# EAGLE design base1 (EAGLE 7.2.0)
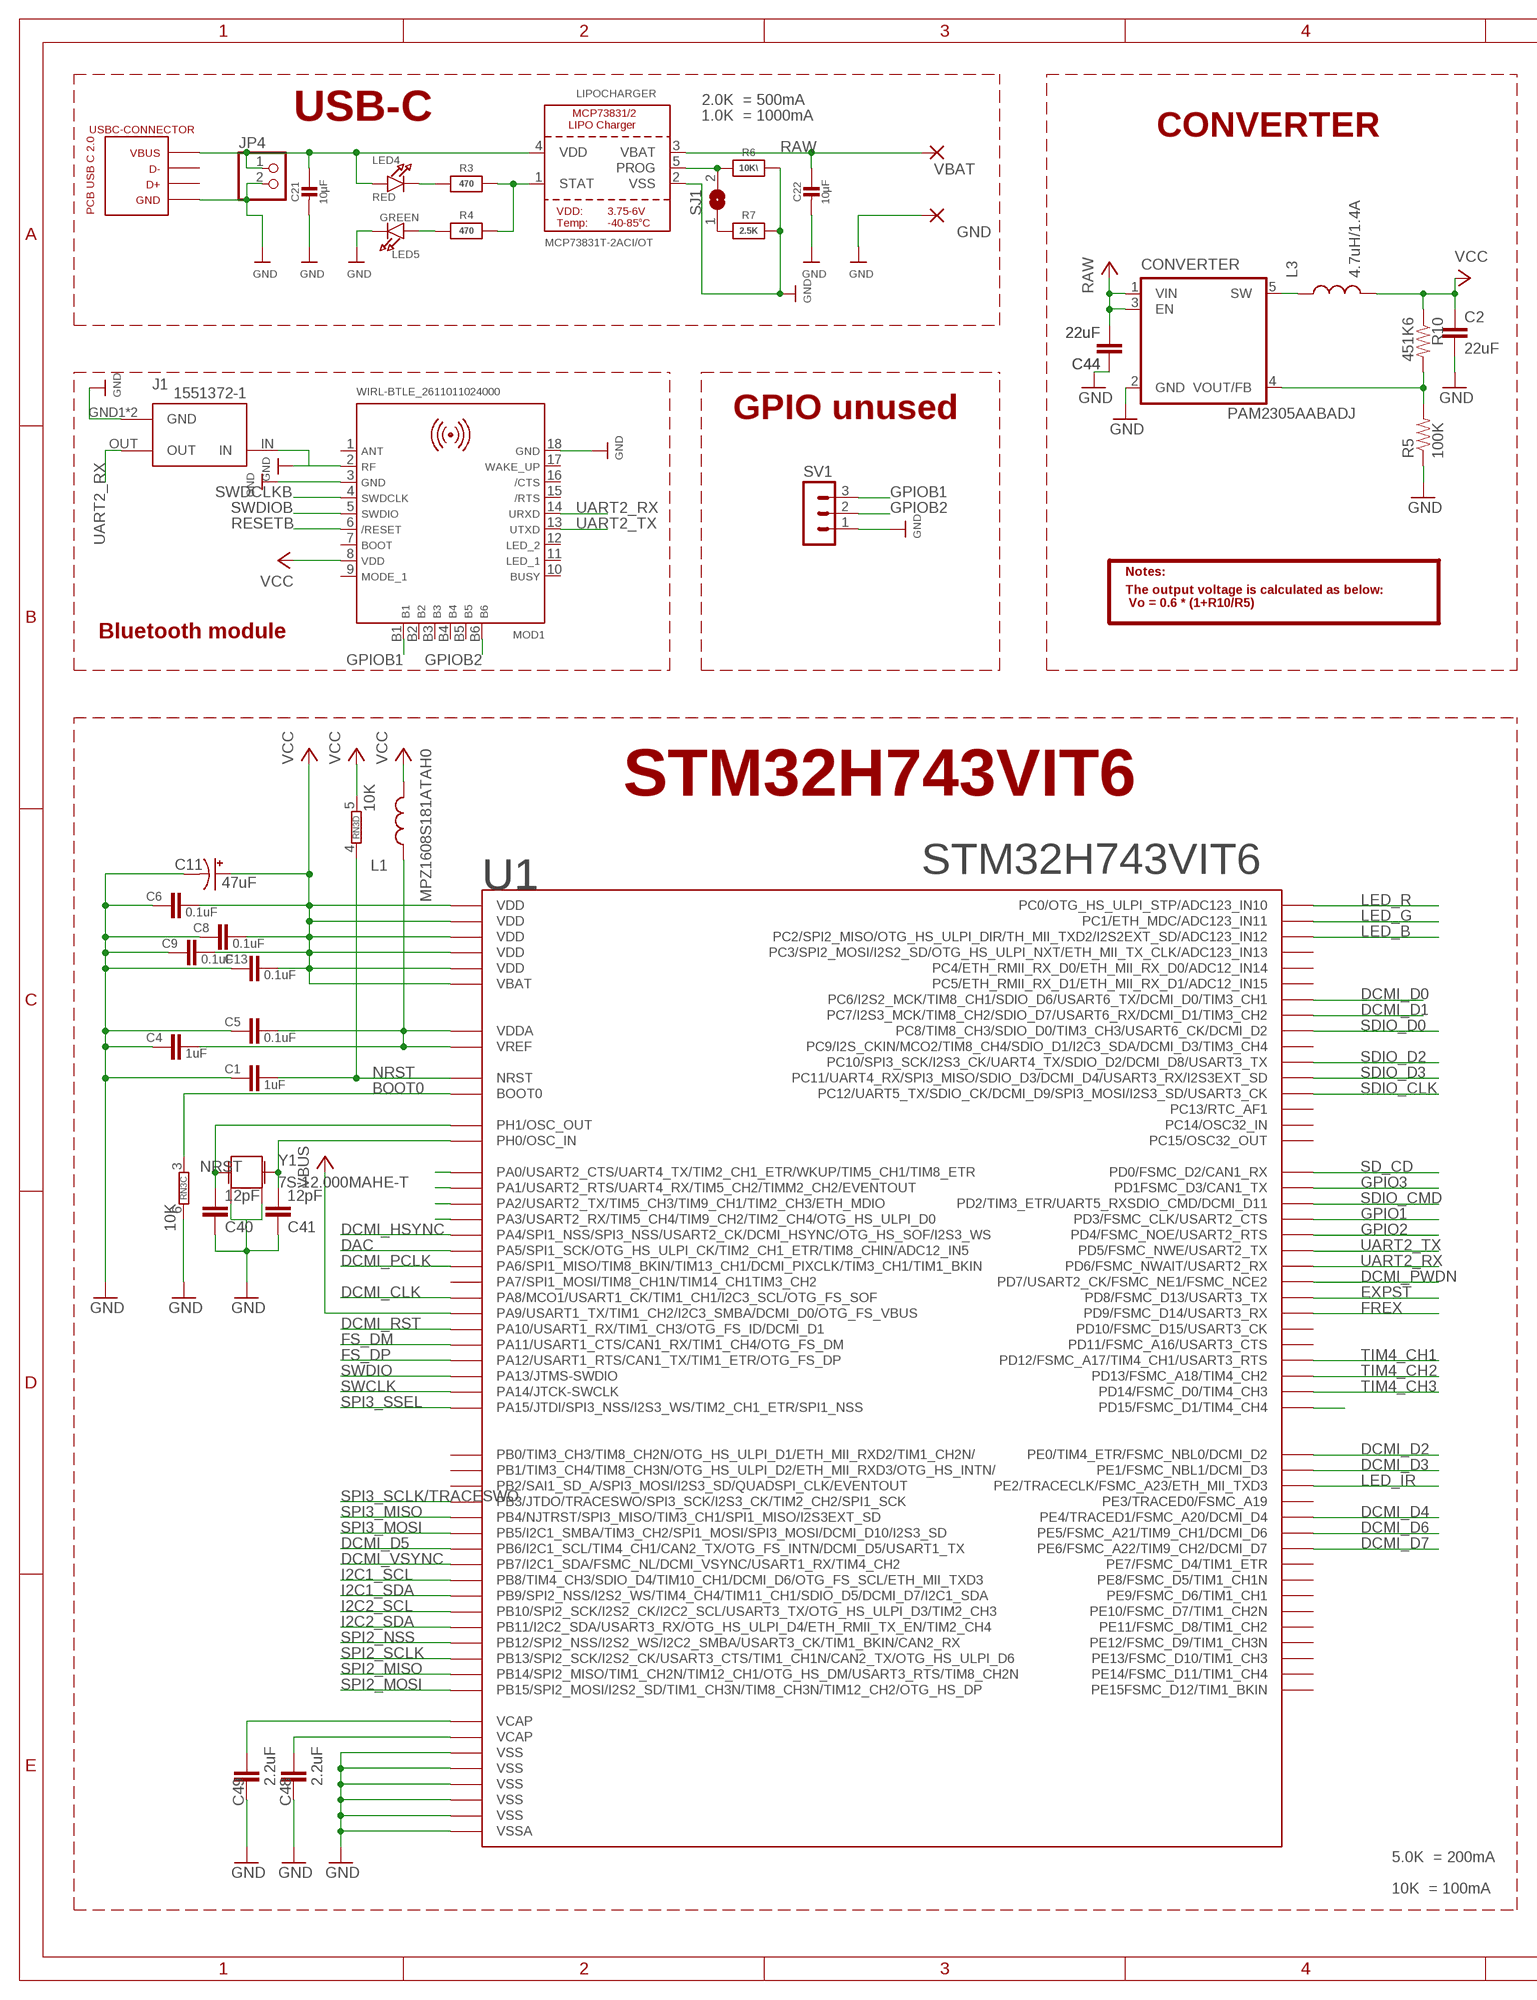
[diagram p0: schematic, sheet 1, part 1 of 2]
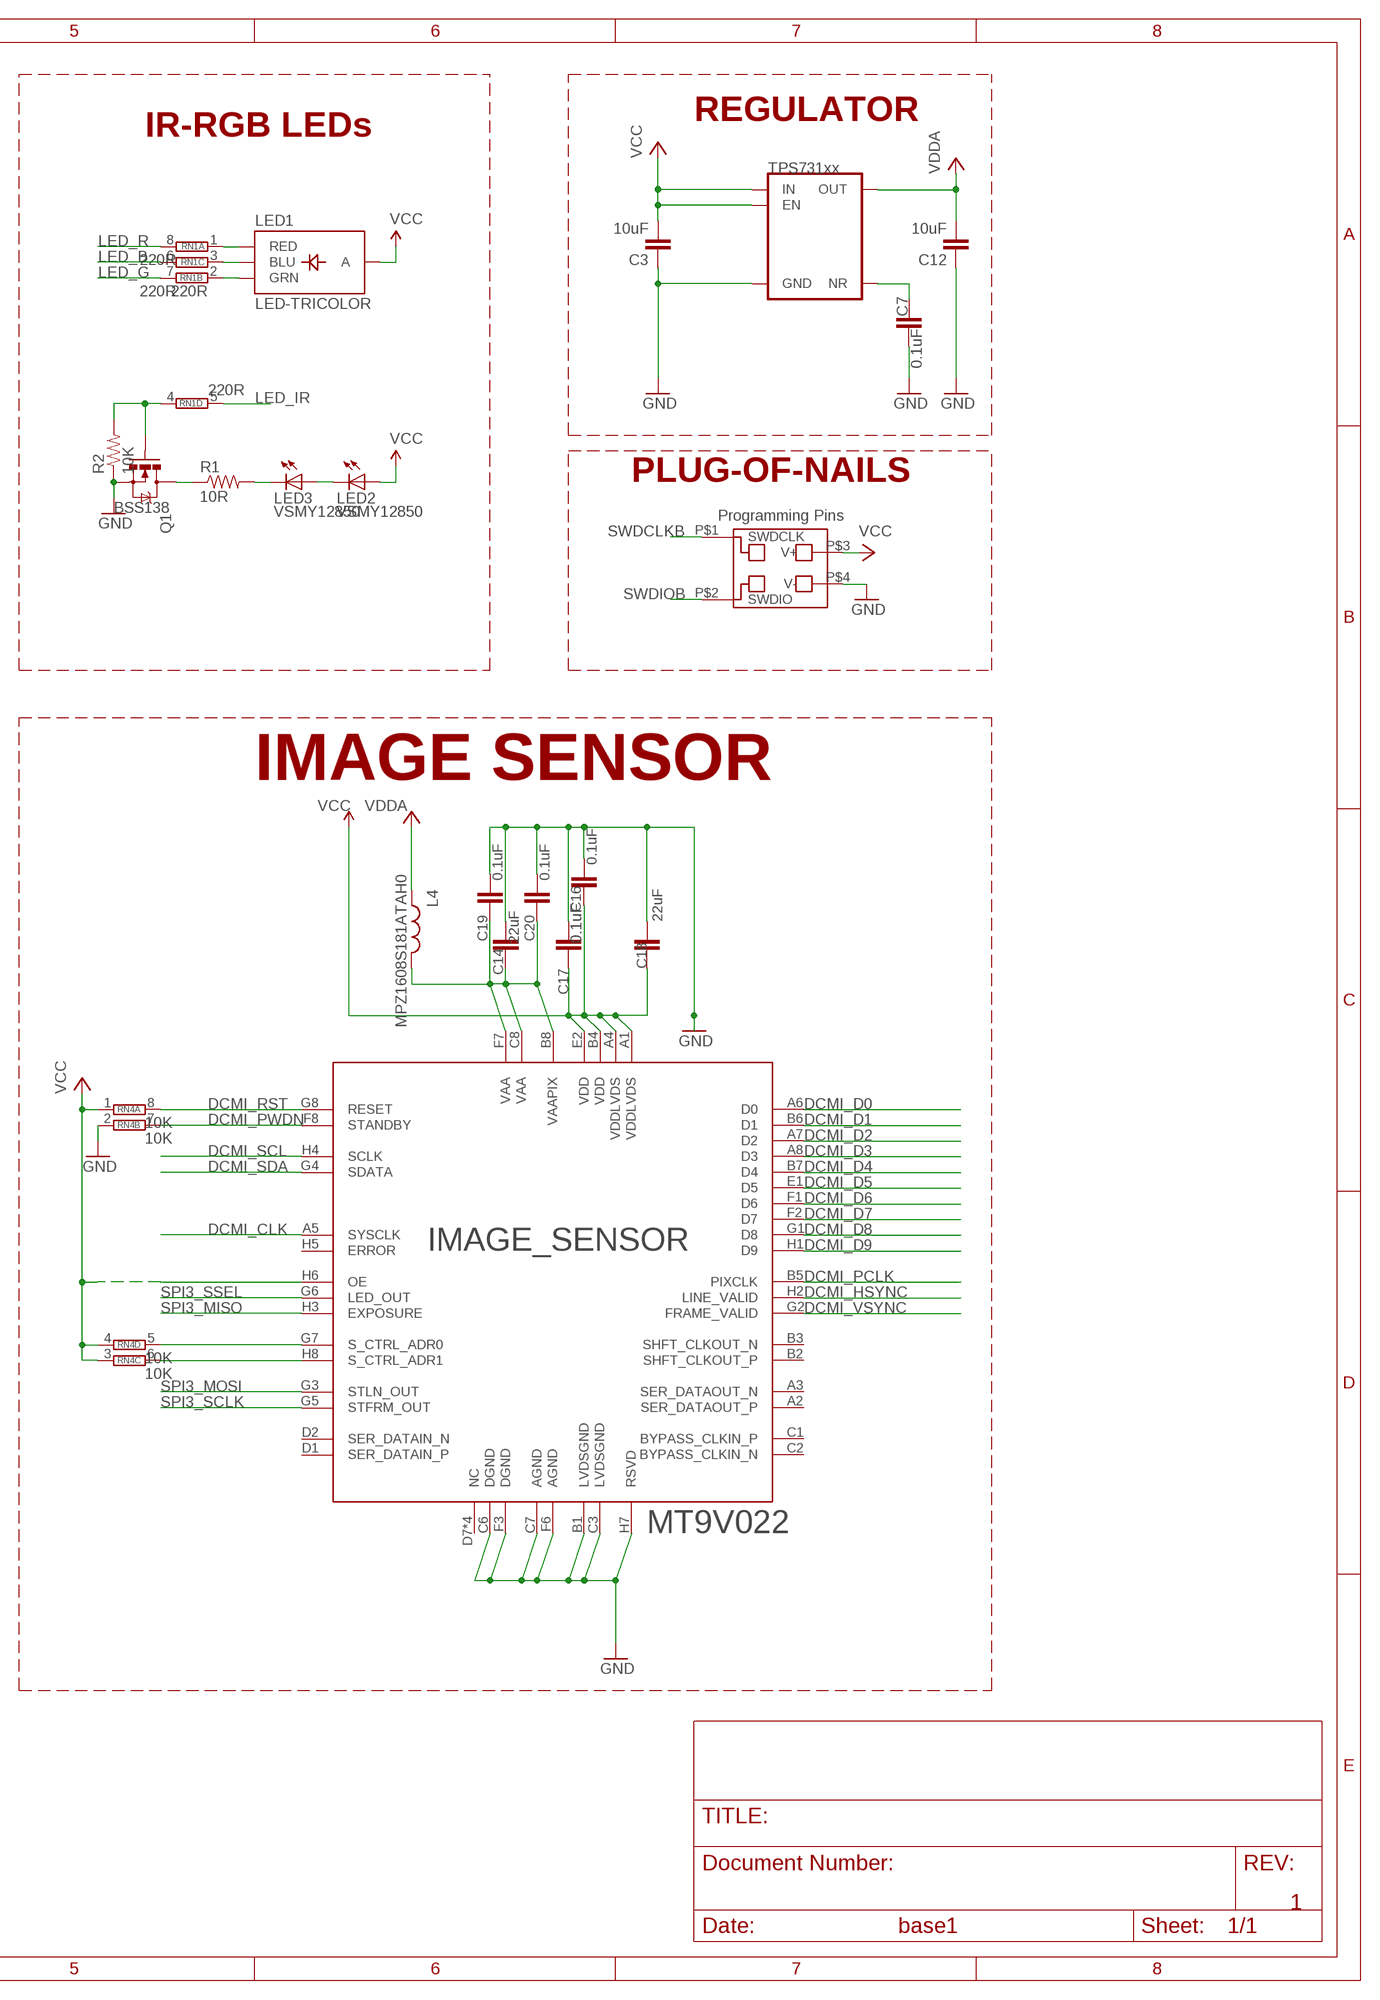
[diagram p1: schematic, sheet 1, part 2 of 2]

## Parts
C1  1uF  CAP0603-CAP  [0603-CAP]
C2  22uF  CAP0805  [0805]
C3  10uF  CAP0805  [0805]
C4  1uF  CAP0603-CAP  [0603-CAP]
C5  0.1uF  CAP0603-CAP  [0603-CAP]
C6  0.1uF  CAP0603-CAP  [0603-CAP]
C7  0.1uF  CAP0603-CAP  [0603-CAP]
C8  0.1uF  CAP0603-CAP  [0603-CAP]
C9  0.1uF  CAP0603-CAP  [0603-CAP]
C11  47uF  CAP_POL1206  [EIA3216]
C12  10uF  CAP0805  [0805]
C13  0.1uF  CAP0603-CAP  [0603-CAP]
C14  22uF  CAP0805  [0805]
C16  0.1uF  CAP0402-CAP  [0402-CAP]
C17  0.1uF  CAP0402-CAP  [0402-CAP]
C18  22uF  CAP0805  [0805]
C19  0.1uF  CAP0402-CAP  [0402-CAP]
C20  0.1uF  CAP0402-CAP  [0402-CAP]
C21  10µF  CAP_CERAMIC0805-NOOUTLINE  [0805-NO]
C22  10µF  CAP_CERAMIC0805-NOOUTLINE  [0805-NO]
C40  12pF  CAP0603-CAP  [0603-CAP]
C41  12pF  CAP0603-CAP  [0603-CAP]
C44  22uF  CAP0805  [0805]
C48  2.2uF  CAP0603-CAP  [0603-CAP]
C49  2.2uF  CAP0603-CAP  [0603-CAP]
CONVERTER  PAM2305AABADJ  PAM2305AAB330  [TSOT25]
GND  SMD2  [SMD1,27-2,54]
IMAGE_SENSOR  MT9V022  [IBGA52]
J1  1551372-1  [TE_1551372-1]
JP4  HEADER-1X2ROUND  [1X02_ROUND]
L1  MPZ1608S181ATAH0  INDUCTOR0603  [0603]
L3  4.7uH/1.4A  INDUCTOR1007  [1007]
L4  MPZ1608S181ATAH0  INDUCTOR0603  [0603]
LED1  LED-TRICOLOR  [LED-TRICOLOR-SMD-MF]
LED2  VSMY12850  LED1206  [LED-1206]
LED3  VSMY12850  LED1206  [LED-1206]
LED4  RED  LED0805_NOOUTLINE  [CHIPLED_0805_NOOUTLINE]
LED5  GREEN  LED0805_NOOUTLINE  [CHIPLED_0805_NOOUTLINE]
LIPOCHARGER  MCP73831T-2ACI/OT  MCP73831/2  [SOT23-5]
MOD1  WIRL-BTLE_2611011024000  [WE-FP-4+]
PROGPINS1  PROGPINS  [PROGPIN]
Q1  BSS138  MOSFET-NCHANNELSMD  [SOT23-3]
R1  10R  RESISTOR0603-RES  [0603-RES]
R2  10K  RESISTOR0603-RES  [0603-RES]
R3  470  RESISTOR0805_NOOUTLINE  [0805-NO]
R4  470  RESISTOR0805_NOOUTLINE  [0805-NO]
R5  100K  RESISTOR0603-RES  [0603-RES]
R6  10K\  RESISTOR0805_NOOUTLINE  [0805-NO]
R7  2.5K  RESISTOR0805_NOOUTLINE  [0805-NO]
R10  451K6  RESISTOR0603-RES  [0603-RES]
REGULATOR  TPS731XX  [SOT23-5]
RN1  220R  4R-NEXBV8V  [EXBV8V]
RN3  10K  4R-NEXBV8V  [EXBV8V]
RN4  10K  4R-NEXBV8V  [EXBV8V]
SJ1  SOLDERJUMPER  [SOLDERJUMPER_ARROW_NOPASTE]
SV1  MA03-1  [MA03-1]
U1  STM32H743VIT6  STM32F746LQFP100  [LQFP100]
USBC-CONNECTOR  PCB_USB_C_2.0DS_2  [USB_TYPE_C_DS_2]
VBAT  SMD2  [SMD1,27-2,54]
Y1  7S-12.000MAHE-T  CRYSTAL2.5X2.0  [CRYSTAL-2.5X2.0]

## Nets
BOOT0: RN3.3 U1.94(BOOT0)
DAC: U1.29(PA5/SPI1_SCK/OTG_HS_ULPI_CK/TIM2_CH1_ETR/TIM8_CHIN/ADC12_IN5)
DCMI_CLK: IMAGE_SENSOR.A5(SYSCLK) U1.67(PA8/MCO1/USART1_CK/TIM1_CH1/I2C3_SCL/OTG_FS_SOF)
DCMI_D0: IMAGE_SENSOR.A6(D0) U1.63(PC6/I2S2_MCK/TIM8_CH1/SDIO_D6/USART6_TX/DCMI_D0/TIM3_CH1)
DCMI_D1: IMAGE_SENSOR.B6(D1) U1.64(PC7/I2S3_MCK/TIM8_CH2/SDIO_D7/USART6_RX/DCMI_D1/TIM3_CH2)
DCMI_D2: IMAGE_SENSOR.A7(D2) U1.97(PE0/TIM4_ETR/FSMC_NBL0/DCMI_D2)
DCMI_D3: IMAGE_SENSOR.A8(D3) U1.98(PE1/FSMC_NBL1/DCMI_D3)
DCMI_D4: IMAGE_SENSOR.B7(D4) U1.3(PE4/TRACED1/FSMC_A20/DCMI_D4)
DCMI_D5: IMAGE_SENSOR.E1(D5) U1.92(PB6/I2C1_SCL/TIM4_CH1/CAN2_TX/OTG_FS_INTN/DCMI_D5/USART1_TX)
DCMI_D6: IMAGE_SENSOR.F1(D6) U1.4(PE5/FSMC_A21/TIM9_CH1/DCMI_D6)
DCMI_D7: IMAGE_SENSOR.F2(D7) U1.5(PE6/FSMC_A22/TIM9_CH2/DCMI_D7)
DCMI_D8: IMAGE_SENSOR.G1(D8)
DCMI_D9: IMAGE_SENSOR.H1(D9)
DCMI_HSYNC: IMAGE_SENSOR.H2(LINE_VALID) U1.28(PA4/SPI1_NSS/SPI3_NSS/USART2_CK/DCMI_HSYNC/OTG_HS_SOF/I2S3_WS)
DCMI_PCLK: IMAGE_SENSOR.B5(PIXCLK) U1.30(PA6/SPI1_MISO/TIM8_BKIN/TIM13_CH1/DCMI_PIXCLK/TIM3_CH1/TIM1_BKIN)
DCMI_PWDN: IMAGE_SENSOR.F8(STANDBY) RN4.7 U1.88(PD7/USART2_CK/FSMC_NE1/FSMC_NCE2)
DCMI_RST: IMAGE_SENSOR.G8(RESET) RN4.8 U1.69(PA10/USART1_RX/TIM1_CH3/OTG_FS_ID/DCMI_D1)
DCMI_SCL: IMAGE_SENSOR.H4(SCLK)
DCMI_SDA: IMAGE_SENSOR.G4(SDATA)
DCMI_VSYNC: IMAGE_SENSOR.G2(FRAME_VALID) U1.93(PB7/I2C1_SDA/FSMC_NL/DCMI_VSYNC/USART1_RX/TIM4_CH2)
EXPST: U1.55(PD8/FSMC_D13/USART3_TX)
FREX: U1.56(PD9/FSMC_D14/USART3_RX)
FS_DM: U1.70(PA11/USART1_CTS/CAN1_RX/TIM1_CH4/OTG_FS_DM)
FS_DP: U1.71(PA12/USART1_RTS/CAN1_TX/TIM1_ETR/OTG_FS_DP)
GND: C1.2 C2.2 C3.1 C4.2 C5.2 C6.2 C7.2 C8.2 C9.2 C11.C(-) C12.1 C13.2 C14.1 C16.2 C17.2 C18.1 C19.2 C20.2 C21.2 C22.2 C40.1 C41.1 C44.1 C48.2 C49.2 CONVERTER.2(GND) GND.1(P) IMAGE_SENSOR.B1(LVDSGND) IMAGE_SENSOR.C3(LVDSGND) IMAGE_SENSOR.C6(DGND) IMAGE_SENSOR.C7(AGND) IMAGE_SENSOR.F3(DGND) IMAGE_SENSOR.F6(AGND) IMAGE_SENSOR.H7(RSVD) J1.GND1(GND) J1.GND2(GND) J1.IN JP4.2 LED5.C LIPOCHARGER.2(VSS) MOD1.2 MOD1.3 MOD1.18 PROGPINS1.P$4(V-) Q1.2(S) R2.1 R5.1 R6.2 R7.2 REGULATOR.2(GND) RN3.6 RN4.2 SV1.1 U1.10(VSS) U1.19(VSSA) U1.26(VSS) U1.49(VSS) U1.74(VSS) U1.99(VSS) USBC-CONNECTOR.A4(VBUS) USBC-CONNECTOR.A9(VBUS) USBC-CONNECTOR.B4(VBUS) USBC-CONNECTOR.B9(VBUS)
GPIO1: U1.84(PD3/FSMC_CLK/USART2_CTS)
GPIO2: U1.85(PD4/FSMC_NOE/USART2_RTS)
GPIO3: U1.82(PD1FSMC_D3/CAN1_TX)
GPIOB1: MOD1.B1 SV1.3
GPIOB2: MOD1.B6 SV1.2
I2C1_SCL: U1.95(PB8/TIM4_CH3/SDIO_D4/TIM10_CH1/DCMI_D6/OTG_FS_SCL/ETH_MII_TXD3)
I2C1_SDA: U1.96(PB9/SPI2_NSS/I2S2_WS/TIM4_CH4/TIM11_CH1/SDIO_D5/DCMI_D7/I2C1_SDA)
I2C2_SCL: U1.46(PB10/SPI2_SCK/I2S2_CK/I2C2_SCL/USART3_TX/OTG_HS_ULPI_D3/TIM2_CH3)
I2C2_SDA: U1.47(PB11/I2C2_SDA/USART3_RX/OTG_HS_ULPI_D4/ETH_RMII_TX_EN/TIM2_CH4)
LED_B: RN1.6 U1.17(PC2/SPI2_MISO/OTG_HS_ULPI_DIR/TH_MII_TXD2/I2S2EXT_SD/ADC123_IN12)
LED_G: RN1.7 U1.16(PC1/ETH_MDC/ADC123_IN11)
LED_IR: RN1.5 U1.1(PE2/TRACECLK/FSMC_A23/ETH_MII_TXD3)
LED_R: RN1.8 U1.15(PC0/OTG_HS_ULPI_STP/ADC123_IN10)
N$1: LED4.C R3.1
N$2: C40.2 U1.13(PH1/OSC_OUT) Y1.3
N$3: LIPOCHARGER.1(STAT) R3.2 R4.2
N$4: C41.2 U1.12(PH0/OSC_IN) Y1.1
N$5: Q1.1(G) R2.2 RN1.4
N$6: LED1.B(BLU) RN1.3
N$8: LED1.R(RED) RN1.1
N$9: LED1.G(GRN) RN1.2
N$10: LED3.C R1.2
N$11: C7.1 REGULATOR.4(NR)
N$12: C4.1 C5.1 L1.1 U1.20(VREF) U1.21(VDDA)
N$13: CONVERTER.4(VOUT/FB) R5.2 R10.2
N$14: Q1.3(D) R1.1
N$15: LIPOCHARGER.5(PROG) R6.1 SJ1.2
N$16: LED5.A R4.1
N$17: LED2.C LED3.A
N$18: R7.1 SJ1.1
N$19: IMAGE_SENSOR.G7(S_CTRL_ADR0) RN4.5
N$20: IMAGE_SENSOR.H8(S_CTRL_ADR1) RN4.6
N$30: U1.62(PD15/FSMC_D1/TIM4_CH4)
N$31: U1.22(PA0/USART2_CTS/UART4_TX/TIM2_CH1_ETR/WKUP/TIM5_CH1/TIM8_ETR)
N$32: U1.23(PA1/USART2_RTS/UART4_RX/TIM5_CH2/TIMM2_CH2/EVENTOUT)
N$33: U1.24(PA2/USART2_TX/TIM5_CH3/TIM9_CH1/TIM2_CH3/ETH_MDIO)
N$34: U1.25(PA3/USART2_RX/TIM5_CH4/TIM9_CH2/TIM2_CH4/OTG_HS_ULPI_D0)
NRST: C1.1 RN3.4 U1.14(NRST)
P$1: Y1.2 Y1.4
RAW: C22.1 C44.2 CONVERTER.1(VIN) CONVERTER.3(EN) LIPOCHARGER.3(VBAT) VBAT.1(P)
RESETB: MOD1.6
SD_CD: U1.81(PD0/FSMC_D2/CAN1_RX)
SDIO_CLK: U1.80(PC12/UART5_TX/SDIO_CK/DCMI_D9/SPI3_MOSI/I2S3_SD/USART3_CK)
SDIO_CMD: U1.83(PD2/TIM3_ETR/UART5_RXSDIO_CMD/DCMI_D11)
SDIO_D0: U1.65(PC8/TIM8_CH3/SDIO_D0/TIM3_CH3/USART6_CK/DCMI_D2)
SDIO_D2: U1.78(PC10/SPI3_SCK/I2S3_CK/UART4_TX/SDIO_D2/DCMI_D8/USART3_TX)
SDIO_D3: U1.79(PC11/UART4_RX/SPI3_MISO/SDIO_D3/DCMI_D4/USART3_RX/I2S3EXT_SD)
SPI2_MISO: U1.53(PB14/SPI2_MISO/TIM1_CH2N/TIM12_CH1/OTG_HS_DM/USART3_RTS/TIM8_CH2N)
SPI2_MOSI: U1.54(PB15/SPI2_MOSI/I2S2_SD/TIM1_CH3N/TIM8_CH3N/TIM12_CH2/OTG_HS_DP)
SPI2_NSS: U1.51(PB12/SPI2_NSS/I2S2_WS/I2C2_SMBA/USART3_CK/TIM1_BKIN/CAN2_RX)
SPI2_SCLK: U1.52(PB13/SPI2_SCK/I2S2_CK/USART3_CTS/TIM1_CH1N/CAN2_TX/OTG_HS_ULPI_D6)
SPI3_MISO: IMAGE_SENSOR.H3(EXPOSURE) U1.90(PB4/NJTRST/SPI3_MISO/TIM3_CH1/SPI1_MISO/I2S3EXT_SD)
SPI3_MOSI: IMAGE_SENSOR.G3(STLN_OUT) U1.91(PB5/I2C1_SMBA/TIM3_CH2/SPI1_MOSI/SPI3_MOSI/DCMI_D10/I2S3_SD)
SPI3_SCLK: IMAGE_SENSOR.G5(STFRM_OUT)
SPI3_SCLK/TRACESWO: U1.89(PB3/JTDO/TRACESWO/SPI3_SCK/I2S3_CK/TIM2_CH2/SPI1_SCK)
SPI3_SSEL: IMAGE_SENSOR.G6(LED_OUT) U1.77(PA15/JTDI/SPI3_NSS/I2S3_WS/TIM2_CH1_ETR/SPI1_NSS)
SW: CONVERTER.5(SW) L3.1
SWCLK: U1.76(PA14/JTCK-SWCLK)
SWDCLKB: MOD1.4 PROGPINS1.P$1(SWDCLK)
SWDIO: U1.72(PA13/JTMS-SWDIO)
SWDIOB: MOD1.5 PROGPINS1.P$2(SWDIO)
TIM4_CH1: U1.59(PD12/FSMC_A17/TIM4_CH1/USART3_RTS)
TIM4_CH2: U1.60(PD13/FSMC_A18/TIM4_CH2)
TIM4_CH3: U1.61(PD14/FSMC_D0/TIM4_CH3)
UART2_RX: J1.OUT MOD1.14 U1.87(PD6/FSMC_NWAIT/USART2_RX)
UART2_TX: MOD1.13 U1.86(PD5/FSMC_NWE/USART2_TX)
VAA: C14.2 C19.1 C20.1 IMAGE_SENSOR.B8(VAAPIX) IMAGE_SENSOR.C8(VAA) IMAGE_SENSOR.F7(VAA) L4.2
VBAT: C2.1 C3.2 C6.1 C8.1 C9.1 C11.A(+) C13.1 C16.1 C17.1 C18.2 IMAGE_SENSOR.A1(VDDLVDS) IMAGE_SENSOR.A4(VDDLVDS) IMAGE_SENSOR.B4(VDD) IMAGE_SENSOR.E2(VDD) IMAGE_SENSOR.H6(OE) L1.2 L3.2 LED1.A LED2.A R10.1 REGULATOR.1(IN) REGULATOR.3(EN) RN3.5 RN4.1 RN4.3 RN4.4 U1.6(VBAT) U1.11(VDD) U1.27(VDD) U1.50(VDD) U1.75(VDD) U1.100(VDD) ; supply symbol labelled VCC
VBUS: U1.68(PA9/USART1_TX/TIM1_CH2/I2C3_SMBA/DCMI_D0/OTG_FS_VBUS)
VCAP1: C49.1 U1.48(VCAP)
VCAP2: C48.1 U1.73(VCAP)
VCC: MOD1.8 PROGPINS1.P$3(V+)
VDD: C21.1 JP4.1 LED4.A LIPOCHARGER.4(VDD) USBC-CONNECTOR.A1(GND) USBC-CONNECTOR.A12(GND) USBC-CONNECTOR.B1(GND) USBC-CONNECTOR.B12(GND)
VDDA: C12.2 L4.1 REGULATOR.5(OUT)
Unconnected: IMAGE_SENSOR.A2(SER_DATAOUT_P) IMAGE_SENSOR.A3(SER_DATAOUT_N) IMAGE_SENSOR.B2(SHFT_CLKOUT_P) IMAGE_SENSOR.B3(SHFT_CLKOUT_N) IMAGE_SENSOR.C1(BYPASS_CLKIN_P) IMAGE_SENSOR.C2(BYPASS_CLKIN_N) IMAGE_SENSOR.D1(SER_DATAIN_P) IMAGE_SENSOR.D2(SER_DATAIN_N) IMAGE_SENSOR.D7(NC) IMAGE_SENSOR.D8(NC) IMAGE_SENSOR.E7(NC) IMAGE_SENSOR.E8(NC) IMAGE_SENSOR.H5(ERROR) MOD1.1 MOD1.7 MOD1.9 MOD1.10 MOD1.11 MOD1.12 MOD1.15 MOD1.16 MOD1.17 MOD1.B2 MOD1.B3 MOD1.B4 MOD1.B5 RN3.1 RN3.2 RN3.7 RN3.8 U1.2(PE3/TRACED0/FSMC_A19) U1.7(PC13/RTC_AF1) U1.8(PC14/OSC32_IN) U1.9(PC15/OSC32_OUT) U1.18(PC3/SPI2_MOSI/I2S2_SD/OTG_HS_ULPI_NXT/ETH_MII_TX_CLK/ADC123_IN13) U1.31(PA7/SPI1_MOSI/TIM8_CH1N/TIM14_CH1TIM3_CH2) U1.32(PC4/ETH_RMII_RX_D0/ETH_MII_RX_D0/ADC12_IN14) U1.33(PC5/ETH_RMII_RX_D1/ETH_MII_RX_D1/ADC12_IN15) U1.34(PB0/TIM3_CH3/TIM8_CH2N/OTG_HS_ULPI_D1/ETH_MII_RXD2/TIM1_CH2N/) U1.35(PB1/TIM3_CH4/TIM8_CH3N/OTG_HS_ULPI_D2/ETH_MII_RXD3/OTG_HS_INTN/) U1.36(PB2/SAI1_SD_A/SPI3_MOSI/I2S3_SD/QUADSPI_CLK/EVENTOUT) U1.37(PE7/FSMC_D4/TIM1_ETR) U1.38(PE8/FSMC_D5/TIM1_CH1N) U1.39(PE9/FSMC_D6/TIM1_CH1) U1.40(PE10/FSMC_D7/TIM1_CH2N) U1.41(PE11/FSMC_D8/TIM1_CH2) U1.42(PE12/FSMC_D9/TIM1_CH3N) U1.43(PE13/FSMC_D10/TIM1_CH3) U1.44(PE14/FSMC_D11/TIM1_CH4) U1.45(PE15FSMC_D12/TIM1_BKIN) U1.57(PD10/FSMC_D15/USART3_CK) U1.58(PD11/FSMC_A16/USART3_CTS) U1.66(PC9/I2S_CKIN/MCO2/TIM8_CH4/SDIO_D1/I2C3_SDA/DCMI_D3/TIM3_CH4) USBC-CONNECTOR.A6(D+) USBC-CONNECTOR.A7(D-) USBC-CONNECTOR.B6(D+) USBC-CONNECTOR.B7(D-)

## Notes on the sheet
- 2.0K  = 500mA
- USB-C | 1.0K  = 1000mA | REGULATOR
- CONVERTER | IR-RGB LEDs
- GPIO unused
- PLUG-OF-NAILS
- Notes:
- The output voltage is calculated as below:
   Vo = 0.6 * (1+R10/R5)
- Bluetooth module
- STM32H743VIT6 | IMAGE SENSOR
- 5.0K  = 200mA
- 10K  = 100mA
- 1

## Library data of the parts
C1-C9 C12-C14 C16-C20 C40 C41 C44 C48 C49 = sfe:CAP: Capacitor Standard 0603 ceramic capacitor, and 0.1" leaded capacitor.
C11 = sfe:CAP_POL: Capacitor Polarized These are standard SMD and PTH capacitors. Normally 10uF, 47uF, and 100uF in electrolytic and tantalum varieties. Always verify the external diameter of the through hole cap, it varies with capacity, voltage, and manufacturer. The EIA devices should be standard.
C21 C22 = microbuilder:CAP_CERAMIC: Ceramic Capacitors For new designs, use the packages preceded by an '_' character since they are more reliable: The following footprints should be used on most boards: _0402 - Standard footprint for regular board layouts _0603 - Standard footprint for regular board layouts _0805 - Standard footprint for regular board layouts _1206 - Standard footprint for regular board layouts For extremely tight-pitch boards where space is at a premium, the following 'micro-pitch' footprints can be used (smaller pads, no silkscreen outline, etc.): _0402MP - Micro-pitch footprint for very dense/compact boards _0603MP - Micro-pitch footprint for very dense/compact boards _0805MP - Micro-pitch footprint for very dense/compact boards _1206MP - Micro-pitch footprint for very dense/compact boards
CONVERTER = regulators:PAM2305AAB330
GND VBAT = wirepad:SMD2: SMD PAD
IMAGE_SENSOR = MT9V022:MT9V022
J1 = 1551372-1:1551372-1: CONN COAX SWITCH JACK STR 50OHM Check availability <https://pricing.snapeda.com/parts/1551372-1/TE%20Connectivity/view-part?ref=eda>; AVAILABILITY: In Stock; CHECK_PRICES: https://www.snapeda.com/parts/1551372-1/TE+Connectivity+AMP+Connectors/view-part/?ref=eda; DESCRIPTION: Coaxial Switch - 1.35mm Plug Dia Connector Jack, Female Socket 50 Ohms Surface Mount Solder; MF: TE Connectivity; MP: 1551372-1; PACKAGE: None; PRICE: None; SNAPEDA_LINK: https://www.snapeda.com/parts/1551372-1/TE+Connectivity+AMP+Connectors/view-part/?ref=snap
JP4 = microbuilder:HEADER-1X2: PIN HEADER
L1 L3 L4 = sfe:INDUCTOR: Inductors Basic Inductor/Choke - 0603 and 1206. Footprints are not proven and vary greatly between part numbers.
LED1 = sfe:LED-TRICOLOR: Tri-Color LED SMD Proven layout and schematic for triple color LED in SMD package - common anode. Spark Fun Electronics SKU : COM-07844
LED2 LED3 = sfe:LED: LEDs Standard schematic elements and footprints for 5mm, 3mm, 1206, and 0603 sized LEDs. 5mm - Spark Fun Electronics SKU : COM-00529 (and others)
LED4 LED5 = microbuilder:LED: LED 0603 - 0603 Surface Mount Package 2mA: Green LED - Low Power (3.9mcd, 2ma, 1.7Vf) - Digikey: 475-2709-2-ND Orange LED - Low Power (9.8mcd, 2ma, 1.8Vf) - Digikey: 475-1194-2-ND Red LED - Low Power (5mcd, 2ma, 1.8Vf) - Digikey: 475-1195-2-ND Yellow LED - Low Power (7mcd, 2ma, 1.8Vf) - Digikey: 475-1196-2-ND 5mA: Blue LED - Low Power (17mcd, 5ma, 2.9Vf) - Digikey: LNJ937W8CRACT-ND 0805 - 0805 Surface Mount Package 2mA: Red LED (8.8mcd, 2mA, 1.8Vf, Clear) - Low Power [Digikey: 475-2510-1-ND] Green LED (5mcd, 2mA, 1.8Vf, Clear) - Low Power [Digikey: 475-2730-1-ND] Yellow LED (11.3mcd, 2mA, 1.8Vf, Clear) - Low Power [Digikey: 475-2555-1-ND] 20mA: Red LED (104mcd, 20mA, Diffused) - LS R976 [Digikey: 475-1278-6-ND] Red LED (12mcd, 20mA, 2.0Vf, Clear) - APT2012EC [Digikey: 754-1128-1-ND] Green LED (15mcd, 20mA, 2.2Vf, Clear) - APT2012GC [Digikey: 754-1131-1-ND] Orange LED (160mcd, 20mA, 2.1Vf, Clear) - APT2012SECK [Digikey: 754-1130-1-ND] 1206 - 1206 Surface Mount Package Green LED (26mcd, 20mA, Diffused) - LG N971 [Digikey: 475-1407-6-ND] Red LED (15mcd, 20mA, Diffused) - LH N974 [Digikey: 475-1416-6-ND] Cree - Cree High-Power Surface Mount LEDs XPEBWT-L1-0000-00D50 - White 111lm 350mA 2.9Vf 6200K 110° XTEAWT-00-0000-00000LEE3 - White 114lm 350mA 2.85Vf 5000K 115° Everlight - Everlight 45-21 Series Surface Mount LEDs 45-21/QK2C-B2832AC2CB2/2T - Warm White 2000mcd 20mA 3.25Vf 3050K 120° 45-21/LK2C-B38452C4CB2/2T - Nuetral White 2000mcd 20mA 3.25Vf 4150K 120° 45-21/LK2C-B50634C6CB2/2T - Cold White 2200mcd 20mA 3.25Vf 5650K 120° PLCC2 Reverse Mount LS T77K-J1L2-1-0-2-R18-Z - Red 11.25mcd 2mA 1.8Vf 630nm 120° LO T77K-L1M2-24-Z - Orange 19.6mcd 2mA 1.8Vf 606nm 120° LY T77K-K2M1-26-Z - Yellow 15.7mcd 2mA 1.8Vf 587nm 120°
LIPOCHARGER = microbuilder:MCP73831/2: MCP73831/2 LIPO Charger VDD: 3.75 - 6V Temp -40 - 85°C Programmable Charge Rate: 15-500mA NOTE: STAT is a tri-state logic output on the MCP73831 and an open-drain output on the MCP73832. SOT23-5 with 4.2V output and tri-state logic on STAT = MCP73831T-2ACI/OT
MOD1 = WE_WIRL_Rev13.0:WIRL-BTLE_2611011024000: Proteus-III - Bluetooth® LE 5.1 Module WIRL-BTLE Bluetooth® LE 5.1 Module Details see: https://we-online.de/katalog/en/article/2611011024000/; HEIGHT: 2mm; MANUFACTURER: Würth Elektronik; NR: 2611011024000
PROGPINS1 = programming:PROGPINS
Q1 = sfe:MOSFET-NCHANNEL
R1 R2 R5 R10 = sfe:RESISTOR: Resistor Basic schematic elements and footprints for 0603, 1206, and PTH resistors.
R3 R4 R6 R7 = microbuilder:RESISTOR: Resistors For new designs, use the packages preceded by an '_' character since they are more reliable: The following footprints should be used on most boards: _0402 - Standard footprint for regular board layouts _0603 - Standard footprint for regular board layouts _0805 - Standard footprint for regular board layouts _1206 - Standard footprint for regular board layouts For extremely tight-pitch boards where space is at a premium, the following 'micro-pitch' footprints can be used (smaller pads, no silkscreen outline, etc.): _0402MP - Micro-pitch footprint for very dense/compact boards _0603MP - Micro-pitch footprint for very dense/compact boards _0805MP - Micro-pitch footprint for very dense/compact boards _1206MP - Micro-pitch footprint for very dense/compact boards
REGULATOR = mux:TPS731XX
RN1 RN3 RN4 = resistor-dil:4R-N: Array Chip Resistor Source: RS Component / Phycomp; OC_FARNELL: unknown; OC_NEWARK: unknown
SJ1 = microbuilder:SOLDERJUMPER: SMD Solder JUMPER Solder the two pads together to create a connection, or remove the solder to break it. REFLOW - Use this footprint for solder paste and reflow ovens. WAVE - Use this footprint for hand-soldering (larger pads). CLOSED - Has a trace between the two pads to ensure it is closed by default. The trace needs to be cut to disable the jumper, and can be closed again by creating a solder bridge between the two pads.; BOM: EXCLUDE
SV1 = con-lstb:MA03-1: PIN HEADER; OC_FARNELL: unknown; OC_NEWARK: unknown
U1 = stm32:STM32F746
USBC-CONNECTOR = USB_pcb_connectors:PCB_USB_C_2.0
Y1 = mux:CRYSTAL: Crystals Various standard crystals. Proven footprints. Spark Fun Electronics SKU : COM-00534

## Net classes
0 GND: width 0.002 mm, drill 0 mm

## Board
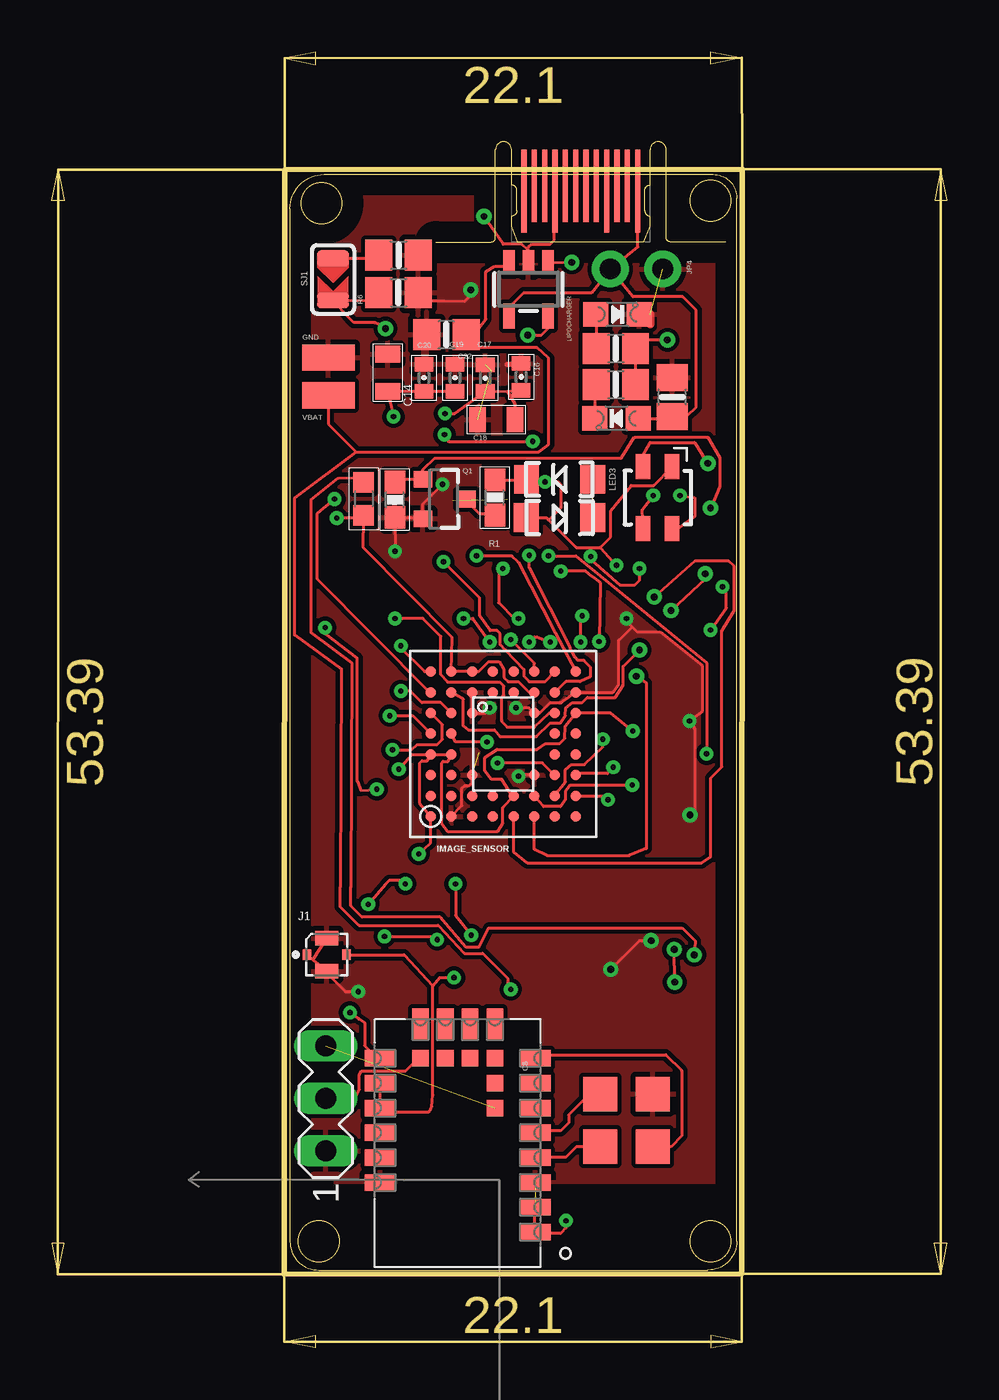
[diagram p2: board, top side]
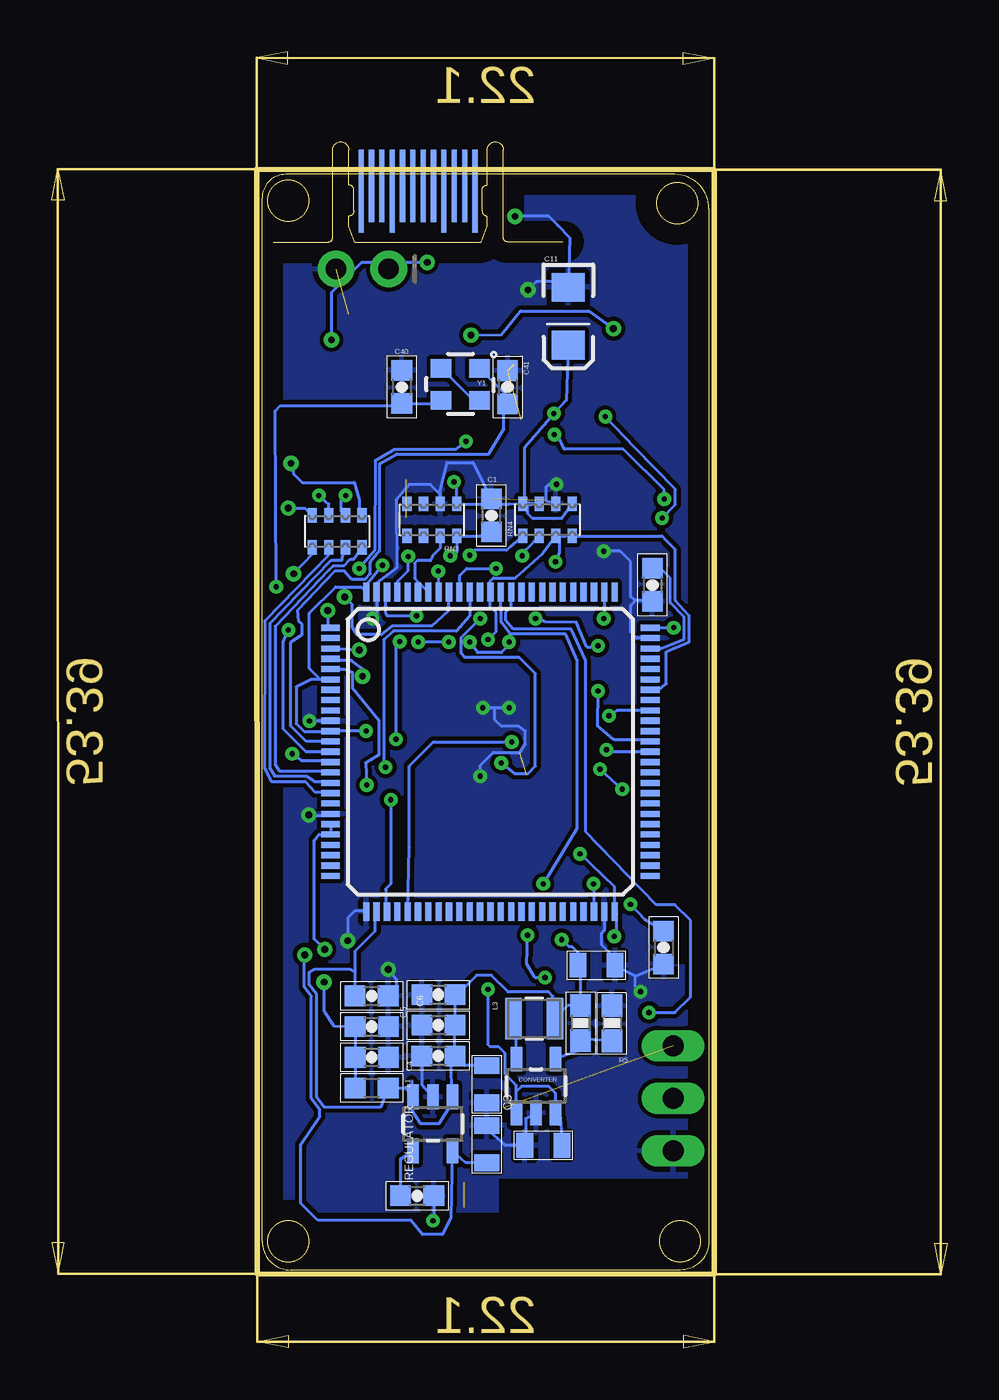
[diagram p3: board, bottom side, seen from below]

Size 22.11 x 53.42 mm. Coordinates in mm from the lower left corner, seen from the top.
Outline: 0,0 22.1,0.03 22.11,53.42 0.01,53.39 0,0
Outline: 1.92,53.16 20.71,53.16 arc-90 21.86,52.02 21.86,1.6 arc-90 20.46,0.2 1.66,0.2 arc-90 0.27,1.6 0.27,51.51 arc-90 1.92,53.16
Outline: circle at 20.59,1.6 radius 0.99
Outline: circle at 1.66,1.6 radius 0.99
Outline: circle at 1.79,51.77 radius 0.99
Outline: circle at 20.59,51.89 radius 0.99
Copper layers (1*16): Top 0.035mm / dielectric 1.5mm / Bottom 0.035mm
Design rules "default": minimum track width 10mil, minimum drill 24mil, track to track 8mil, track to pad 8mil, pad to pad 8mil, via to via 8mil, smd to smd 8mil, copper to edge 40mil, drill to drill 8mil, minimum pad ring 10mil, minimum via ring 8mil, stop-mask expansion 4mil, vias tented up to drill 0mil, thermal gap 10mil

### Footprints (pad centres in the part's own frame; a part is rotated, then mirrored left to right if it is on the bottom)
0603-CAP = smd 1 x 1: 1 -0.8,0; 2 0.8,0
0805 = smd 0.8 x 1.2: 1 -0.9,0; 2 0.9,0
EIA3216 = smd 1.4 x 1.6: A 1.4,0; C -1.4,0
0402-CAP = smd 0.7 x 0.9: 1 -0.65,0; 2 0.65,0
0805-NO = smd 1.3 x 1.5: 1 -0.95,0; 2 0.95,0
TSOT25 = smd 0.55 x 1.2: 1 -0.95,-1.3; 2 0,-1.3; 3 0.95,-1.3; 4 0.95,1.3; 5 -0.95,1.3
SMD1,27-2,54 = smd 1.27 x 2.54: 1 0,0
IBGA52 = smd 0.5 x 0.5: A1 -3.5,3.5; A2 -2.5,3.5; A3 -1.5,3.5; A4 -0.5,3.5; A5 0.5,3.5; A6 1.5,3.5; A7 2.5,3.5; A8 3.5,3.5; B1 -3.5,2.5; B2 -2.5,2.5; B3 -1.5,2.5; B4 -0.5,2.5; B5 0.5,2.5; B6 1.5,2.5; B7 2.5,2.5; B8 3.5,2.5; C1 -3.5,1.5; C2 -2.5,1.5; C3 -1.5,1.5; C6 1.5,1.5; C7 2.5,1.5; C8 3.5,1.5; D1 -3.5,0.5; D2 -2.5,0.5; D7 2.5,0.5; D8 3.5,0.5; E1 -3.5,-0.5; E2 -2.5,-0.5; E7 2.5,-0.5; E8 3.5,-0.5; F1 -3.5,-1.5; F2 -2.5,-1.5; F3 -1.5,-1.5; F6 1.5,-1.5; F7 2.5,-1.5; F8 3.5,-1.5; G1 -3.5,-2.5; G2 -2.5,-2.5; G3 -1.5,-2.5; G4 -0.5,-2.5; G5 0.5,-2.5; G6 1.5,-2.5; G7 2.5,-2.5; G8 3.5,-2.5; H1 -3.5,-3.5; H2 -2.5,-3.5; H3 -1.5,-3.5; H4 -0.5,-3.5; H5 0.5,-3.5; H6 1.5,-3.5; H7 2.5,-3.5; H8 3.5,-3.5
TE_1551372-1 = smd 1.1 x 0.7: GND1 0,0.8; GND2 0,-0.8 | smd 0.4 x 0.5: IN -0.95,0; OUT 0.95,0
1X02_ROUND = drill 1 pad 1.778: 1 -1.27,0; 2 1.27,0
0603 = smd 1 x 1: 1 -0.8,0; 2 0.8,0
1007 = smd 2 x 0.8: 1 0,1; 2 0,-1
LED-TRICOLOR-SMD-MF = smd 0.7 x 1.2: A 0.7,1.5; B 0.7,-1.5; G -0.7,-1.5; R -0.7,1.5
LED-1206 = smd 1.2 x 1.4: A -1.6,0; C 1.6,0
CHIPLED_0805_NOOUTLINE = smd 1.2 x 1.2: A 0,-1.05; C 0,1.05
SOT23-5 = smd 0.55 x 1.2: 1 -0.95,-1.3; 2 0,-1.3; 3 0.95,-1.3; 4 0.95,1.3; 5 -0.95,1.3
WE-FP-4+ = smd 0.8 x 1.5: 1 -4.3,-3.75; 2 -3.1,-3.75; 3 -1.9,-3.75; 4 -0.7,-3.75; 5 0.5,-3.75; 6 1.7,-3.75; 7 2.9,-3.75; 8 4.1,-3.75; 13 4.1,3.75; 14 2.9,3.75; 15 1.7,3.75; 16 0.5,3.75; 17 -0.7,3.75; 18 -1.9,3.75 | smd 1.5 x 0.8: 9 5.75,-1.8; 10 5.75,-0.6; 11 5.75,0.6; 12 5.75,1.8 | smd 0.8 x 0.8: B1 1.7,-1.8; B2 2.9,-1.8; B3 4.1,-1.8; B4 4.1,-0.6; B5 4.1,0.6; B6 4.1,1.8
PROGPIN = smd 1.651 x 1.651: P$1 -1.27,1.27; P$2 1.27,1.27; P$3 -1.27,-1.27; P$4 1.27,-1.27
SOT23-3 = smd 0.8 x 0.9: 1 -0.95,-1; 2 0.95,-1; 3 0,1.1
0603-RES = smd 1.1 x 1: 1 -0.85,0; 2 0.85,0
EXBV8V = smd 0.45 x 0.7: 1 -1.2,-0.775; 2 -0.4,-0.775; 3 0.4,-0.775; 4 1.2,-0.775; 5 1.2,0.775; 6 0.4,0.775; 7 -0.4,0.775; 8 -1.2,0.775
SOLDERJUMPER_ARROW_NOPASTE = smd 0.762 x 1.524: 1 -1.016,0; 2 1.016,0
MA03-1 = drill 1.016 long: 1 -2.54,0; 2 0,0; 3 2.54,0
LQFP100 = smd 0.9 x 0.3: 1 -7.72,6; 2 -7.72,5.5; 3 -7.72,5; 4 -7.72,4.5; 5 -7.72,4; 6 -7.72,3.5; 7 -7.72,3; 8 -7.72,2.5; 9 -7.72,2; 10 -7.72,1.5; 11 -7.72,1; 12 -7.72,0.5; 13 -7.72,0; 14 -7.72,-0.5; 15 -7.72,-1; 16 -7.72,-1.5; 17 -7.72,-2; 18 -7.72,-2.5; 19 -7.72,-3; 20 -7.72,-3.5; 21 -7.72,-4; 22 -7.72,-4.5; 23 -7.72,-5; 24 -7.72,-5.5; 25 -7.72,-6; 51 7.72,-6; 52 7.72,-5.5; 53 7.72,-5; 54 7.72,-4.5; 55 7.72,-4; 56 7.72,-3.5; 57 7.72,-3; 58 7.72,-2.5; 59 7.72,-2; 60 7.72,-1.5; 61 7.72,-1; 62 7.72,-0.5; 63 7.72,0; 64 7.72,0.5; 65 7.72,1; 66 7.72,1.5; 67 7.72,2; 68 7.72,2.5; 69 7.72,3; 70 7.72,3.5; 71 7.72,4; 72 7.72,4.5; 73 7.72,5; 74 7.72,5.5; 75 7.72,6 | smd 0.3 x 0.9: 26 -6,-7.72; 27 -5.5,-7.72; 28 -5,-7.72; 29 -4.5,-7.72; 30 -4,-7.72; 31 -3.5,-7.72; 32 -3,-7.72; 33 -2.5,-7.72; 34 -2,-7.72; 35 -1.5,-7.72; 36 -1,-7.72; 37 -0.5,-7.72; 38 0,-7.72; 39 0.5,-7.72; 40 1,-7.72; 41 1.5,-7.72; 42 2,-7.72; 43 2.5,-7.72; 44 3,-7.72; 45 3.5,-7.72; 46 4,-7.72; 47 4.5,-7.72; 48 5,-7.72; 49 5.5,-7.72; 50 6,-7.72; 76 6,7.72; 77 5.5,7.72; 78 5,7.72; 79 4.5,7.72; 80 4,7.72; 81 3.5,7.72; 82 3,7.72; 83 2.5,7.72; 84 2,7.72; 85 1.5,7.72; 86 1,7.72; 87 0.5,7.72; 88 0,7.72; 89 -0.5,7.72; 90 -1,7.72; 91 -1.5,7.72; 92 -2,7.72; 93 -2.5,7.72; 94 -3,7.72; 95 -3.5,7.72; 96 -4,7.72; 97 -4.5,7.72; 98 -5,7.72; 99 -5.5,7.72; 100 -6,7.72
USB_TYPE_C_DS_2 = smd 0.25 x 4: A1 2.75,-2.45; A4 1.25,-2.45; A9 -1.25,-2.45; A12 -2.75,-2.45 | smd 0.25 x 3.5: A2 2.25,-2.7; A3 1.75,-2.7; A5 0.75,-2.7; A6 0.25,-2.7; A7 -0.25,-2.7; A8 -0.75,-2.7; A10 -1.75,-2.7; A11 -2.25,-2.7 | smd 0.25 x 4 bottom: B1 -2.75,-2.45; B4 -1.25,-2.45; B9 1.25,-2.45; B12 2.75,-2.45 | smd 0.25 x 3.5 bottom: B2 -2.25,-2.7; B3 -1.75,-2.7; B5 -0.75,-2.7; B6 -0.25,-2.7; B7 0.25,-2.7; B8 0.75,-2.7; B10 1.75,-2.7; B11 2.25,-2.7
CRYSTAL-2.5X2.0 = smd 1 x 0.9: 1 -0.95,-0.8; 2 0.9,-0.8; 3 0.9,0.75; 4 -0.95,0.75

### Placement (x,y rotation side)
C1  10.77,36.68 90 bottom
C2  5.7,14.94 0 bottom
C3  11.01,9.19 90 bottom
C4  16.55,10.49 0 bottom
C5  16.55,11.97 0 bottom
C6  16.56,13.45 0 bottom
C7  14.37,3.8 0 bottom
C8  13.34,10.55 180 bottom
C9  13.34,12.04 180 bottom
C11  7.06,46.3 270 bottom
C12  11,6.29 270 bottom
C13  13.34,13.51 180 bottom
C14  4.99,43.57 270 top
C16  11.44,43.37 90 top
C17  9.7,43.32 90 top
C18  10.24,41.31 0 top
C19  8.24,43.33 90 top
C20  6.74,43.33 90 top
C21  18.74,42.4 90 top
C22  7.83,45.41 180 top
C40  15.11,42.89 270 bottom
C41  9.99,42.87 270 bottom
C44  8.27,6.24 0 bottom
C48  3,33.32 270 bottom
C49  2.46,15.79 270 bottom
CONVERTER  8.62,9.1 0 bottom
GND  2.12,44.3 270 top
IMAGE_SENSOR  10.57,25.63 90 top
J1  2.05,15.44 0 top
JP4  17.01,48.59 180 bottom
L1  16.56,9 0 bottom
L3  8.71,12.36 90 bottom
L4  3.83,37.48 270 top
LED1  18.03,37.54 0 top
LED2  13.29,36.57 0 top
LED3  13.3,38.42 180 top
LED4  16.04,41.37 90 top
LED5  16.09,46.4 270 top
LIPOCHARGER  11.79,47.61 180 top
MOD1  8.37,6.34 90 top
PROGPINS1  16.52,7.44 90 top
Q1  7.69,37.47 270 top
R1  10.17,37.55 90 top
R2  5.34,37.44 90 top
R3  16.01,43 0 top
R4  16.01,44.75 0 top
R5  4.96,12.13 270 bottom
R6  5.51,47.44 0 top
R7  5.52,49.26 0 top
R10  6.47,12.14 270 bottom
REGULATOR  13.61,7.27 180 bottom
RN1  18.23,35.91 180 bottom
RN3  13.65,36.46 0 bottom
RN4  8.07,36.47 180 bottom
SJ1  2.35,48.09 270 top
SV1  2,8.51 90 top
U1  10.82,25.25 0 bottom
USBC-CONNECTOR  14.32,49.9 180 top
VBAT  2.13,42.48 270 top
Y1  12.31,42.99 180 bottom

### Tracks (layer width: path | path; a pad name or v marks a point on that pad's centre or on a via)
BOOT0
  Bottom 0.152: RN3.3 13.25,35.1 13.6,34.75 13.73,34.49 14.36,34.49 14.49,34.37 14.49,33.64 U1.94 13.86,33.01
DCMI_CLK  (via drill 0.25)
  Top 0.152: v5.09,27 6.2,27 IMAGE_SENSOR.A5
  Bottom 0.152: U1.67 4.71,27.25 v5.09,27
DCMI_D0  (via drill 0.25)
  Top 0.152: v5.22,25.35 6.13,25.35 6.41,25.6 7.38,25.6 7.63,25.86 7.63,26.57 IMAGE_SENSOR.A6
  Bottom 0.152: U1.63 5.12,25.25 v5.22,25.35
DCMI_D1  (via drill 0.25)
  Top 0.152: 8.02,27.13 IMAGE_SENSOR.B6 7.56,27.64 6.64,27.64 6.08,28.19 v5.63,28.19
  Bottom 0.152: v5.63,28.19 5.65,26.52 4.86,25.86 3.21,25.86 U1.64
DCMI_D2  (via drill 0.25)
  Top 0.152: IMAGE_SENSOR.A7 7.01,28.13 1.59,33.6 1.59,36.78 v2.43,37.47 | v7.73,40.59 7.94,40.26 v12,40.26 | v14.8,34.7 14.85,34.52 16.24,33.3 16.9,33.3 17.16,33.55 v17.16,34.11
  Bottom 0.152: v2.43,37.47 2.43,37.92 4.31,39.78 4.41,39.88 7.25,39.88 7.53,40.46 v7.73,40.59 | v17.16,34.11 16.73,34.62 16.42,34.98 16.4,39.32 15.46,39.88 12.48,39.88 v12,40.26 | U1.97 15.3,33.5 14.8,34.01 v14.8,34.7
DCMI_D3  (via drill 0.25)
  Top 0.152: IMAGE_SENSOR.A8 6.77,29.13 5.63,30.28 v5.63,30.38 | v8.65,31.7 9.11,31.7 v9.92,30.56 | v11.82,30.56 12.08,30.81 12.2,30.81 v12.84,30.56 | v14.31,30.56 14.31,31.6 v14.39,31.83
  Bottom 0.152: v9.92,30.56 9.92,30.43 10.3,30.05 11.44,30.05 v11.82,30.56 | v12.84,30.56 v14.31,30.56 | v14.39,31.83 15.81,31.83 15.89,32 15.89,32.91 U1.98 | v8.65,31.7 8.45,31.7 8.17,31.55 6.67,31.52 6.16,30.33 5.68,30.33 v5.63,30.38
DCMI_D4  (via drill 0.33)
  Top 0.152: 16.9,29.92 v17.16,30.18 16.37,29.39 16.37,28.47 15.99,27.89 14.64,27.89 14.39,27.64 13.93,27.64 13.6,27.38 13.58,27 13.32,26.64 12.84,26.64 12.18,25.98 10.43,25.98 10.15,26.31 8.88,26.31 8.65,26.49 8.65,27.8 IMAGE_SENSOR.B7
  Bottom 0.152: v17.16,30.18 U1.3
DCMI_D5  (via drill 0.33)
  Top 0.152: v17.87,32.74 19.82,34.47 21.48,34.47 21.73,34.24 21.73,32.08 21.13,31.09 21.13,24.52 20.59,23.98 20.59,20.17 20.16,19.89 11.74,19.89 11.07,20.41 IMAGE_SENSOR.E1
  Bottom 0.152: U1.92 12.84,32.08 13.65,31.34 15.58,31.34 16.09,30.91 17.29,30.91 17.49,31.29 17.49,32.36 v17.87,32.74
DCMI_D6  (via drill 0.33)
  Top 0.152: v17.01,28.91 17.49,28.58 17.49,20.57 16.66,20.24 12.68,20.24 12.07,20.53 IMAGE_SENSOR.F1
  Bottom 0.152: v17.01,28.91 17.01,29.29 17.54,29.67 18.46,29.67 U1.4
DCMI_D7  (via drill 0.25)
  Top 0.152: IMAGE_SENSOR.F2 12.52,22.61 13.35,22.61 13.58,22.94 13.58,23.32 13.78,23.62 16.47,23.62 16.5,23.65 v16.8,23.65
  Bottom 0.152: U1.5 17.89,29.25 17.49,29.11 17.49,28.35 16.22,26.77 16.22,25.1 16.85,24.71 v16.8,23.65
DCMI_HSYNC  (via drill 0.25)
  Top 0.152: IMAGE_SENSOR.H2 15.44,23.13 v15.63,22.94
  Bottom 0.152: v15.63,22.94 15.63,18.87 15.89,18.62 15.89,17.6 U1.28
DCMI_PCLK  (via drill 0.25)
  Top 0.152: v9.79,25.73 8.27,25.73 IMAGE_SENSOR.B5
  Bottom 0.152: U1.30 14.74,20.65 14.74,24.56 13.58,25.73 v9.79,25.73
DCMI_PWDN  (via drill 0.25)
  Top 0.152: IMAGE_SENSOR.F8 12.08,29.54 v10.93,30.68
  Bottom 0.152: RN4.7 8.3,34.84 9.61,33.66 10.68,33.66 10.82,33.51 U1.88 10.82,32.25 10.55,31.98 10.55,31.06 v10.93,30.68
DCMI_RST  (via drill 0.25)
  Top 0.152: IMAGE_SENSOR.G8 12.59,28.65 11.82,28.65 11.57,28.91 11.57,29.23 10.68,30.18 10.43,30.43 10.43,30.96 10.27,31.12 9.94,31.12 9.44,31.83 9.44,32.69 v7.68,34.44
  Bottom 0.152: U1.69 3.09,28.27 2.7,28.22 2.32,28.55 2.32,30.1 1.23,30.56 1.23,31.85 1.89,32.56 1.89,35.03 2.33,35.46 2.53,35.69 RN4.8 7.5,35.64 7.51,35.64 7.51,34.87 v7.68,34.44
DCMI_VSYNC  (via drill 0.25)
  Top 0.152: IMAGE_SENSOR.G2 13.07,23.17 13.58,23.8 13.58,24.38 13.88,24.64 14.49,24.64 15.38,25.48 v15.38,25.86 | v13.35,33.98 14.57,33.98 14.87,33.73 15.25,33.43 v15.2,30.58
  Bottom 0.152: 15.25,30.43 v15.2,30.58 15.38,30.3 v15.38,25.86 | v13.35,33.98 13.35,33 U1.93
GND  (via drill 0.25, 0.33)  (6 unrouted)
  Top 0.152: USBC-CONNECTOR.B9 13.09,52.33 13.09,50.5 13.03,50.43 13.03,49.99 12.84,49.78 11.95,49.78 11.79,49.64 11.79,49.51 | 9.07,23.99 IMAGE_SENSOR.C3 9.07,23.77 8.93,23.62 8.73,23.62 8.57,23.47 8.57,22.66 IMAGE_SENSOR.B1 | v19.6,22.2 19.82,22.43 19.82,26.37 19.65,26.64 v19.57,26.75 20.18,27.2 20.18,29.41 18.15,31.04 17.03,31.06 16.8,31.29 | 5.34,35.14 v5.35,34.95 R2.1 6.62,36.59 Q1.2 6.69,37.23 v7.63,38.18 | v13.6,2.59 13.6,2.24 13.35,1.98 12.23,1.98 12.1,2.11 12.1,3.22 MOD1.2 | LIPOCHARGER.2 11.79,49.51 | 11.79,49.51 11.46,49.78 10.57,49.78 v9.64,51.13 | IMAGE_SENSOR.C7 IMAGE_SENSOR.C6 9.73,27.13 v9.92,27.38 | IMAGE_SENSOR.F3 11.36,24.13 v11.32,24.08 | 16.8,31.29 16.52,31.57 v16.52,31.7 | 16.8,31.29 16.14,30.63 16.14,28.52 15.89,28.14 15.87,28.13 IMAGE_SENSOR.H7 13.38,27.64 12.84,27.64 12.33,27.13 IMAGE_SENSOR.F6 11.82,27.38 v11.19,27.38 | v15.76,14.73 17.16,16.13 v17.72,16.13 | R6.2 6.87,47.03 6.92,47.03 7.7,47.03 8.7,47.02 9,47.32 v9,47.58 | 1.37,15.19 J1.GND2 2.21,14.39 2.93,13.67 v3.57,13.67 | J1.IN 1.37,15.19 | 1.37,15.19 J1.GND1
  Top 0.254: 10.78,43.98 C16.2
  Top 0.406: LED5.C 17.67,46.4 17.67,45.92
  Bottom 0.152: C13.2 14.13,13.94 | U1.10 v19.57,26.75 | v19.6,22.2 19.57,22.17 18.62,22.17 U1.19 | 3.82,32.59 4.05,32.74 4.05,34.44 4.56,34.95 v5.35,34.95 | 3.82,32.59 3.06,32.59 C48.2 | U1.74 3.77,30.75 4.05,31.06 4.05,32.33 3.82,32.59 | C8.2 14.14,9.17 REGULATOR.2 | C7.2 13.57,2.4 v13.6,2.59 | C2.2 4.71,14.43 4.59,14.43 | C12.1 11,7 10.16,6.28 10.11,6.22 10.09,6.24 C44.1 9.12,6.28 9.12,7.53 CONVERTER.2 | 16.82,17.5 U1.26 16.84,17.55 17.39,17.55 17.72,17.22 v17.72,16.13 | v15.76,14.73 15.38,14.28 15.38,13.83 C6.2 | U1.49 5.32,16.61 5.47,16.46 5.47,15.95 4.71,15.19 4.71,14.47 C2.2 | v9.64,51.13 8.01,51.13 7.58,50.7 6.99,50.11 C11.C 7.8,47.97 8.61,47.97 v9,47.58 | v9.92,27.38 10.6,27.38 | 10.6,27.38 v11.19,27.38 | v7.63,38.18 8.01,38.18 8.14,38.05 8.14,37.4 RN4.2 | v11.32,24.08 11.32,24.59 10.68,25.22 9.41,25.22 9.13,25.63 9.13,26.26 9.44,26.47 10.3,26.49 10.58,26.77 arc90 10.6,26.8 10.6,27.38 | C1.2 11.67,39.24 12.92,39.24 13.25,37.89 RN3.6 13.25,37.7 13.73,38.18 14.74,38.18 15.38,37.41 15.35,34.14 16.32,33.42 U1.99 16.32,31.9 v16.52,31.7 | C2.2 3.8,14.43 | 3.8,14.43 C49.2 | v3.57,13.67 3.82,13.92 3.82,14.41 3.8,14.43
  Bottom 0.254: 11.01,7.2 C12.1 | 13.55,8.58 REGULATOR.2
  pour Bottom: 0.01,53.42 22.11,53.29 22.11,53.16 22.17,3.07 -0.05,3.07 0.01,4.39
  pour Top: 0.05,53.35 21.98,53.29 22.1,4.43 0,4.43
GPIOB1  (1 unrouted)
GPIOB2
  Top 0.152: SV1.2 2.98,8.51 3.43,8.52 3.62,8.92 3.62,9.63 3.72,9.83 5.85,9.83 6.47,10.44 MOD1.B6
LED_B
  Bottom 0.152: RN1.6 18.68,34.72 21.73,31.57 21.74,24.46 21.41,23.83 19.77,23.83 19.32,23.32 18.61,23.32 U1.17
LED_G
  Bottom 0.152: U1.16 18.62,23.83 19.32,23.83 19.72,24.08 21.25,24.08 21.48,24.46 21.48,31.45 18.5,34.52 18,34.52 RN1.7
LED_IR  (via drill 0.33)
  Top 0.152: v20.33,33.86 20.33,33.6 v18.68,32.08
  Bottom 0.152: RN1.5 19.41,34.84 v20.33,33.86 | v18.68,32.08 18.68,31.39 U1.1
LED_R
  Bottom 0.152: U1.15 18.62,24.33 21.02,24.33 21.22,24.64 21.22,31.32 18.63,34.04 18.43,34.24 17.92,34.24 17.59,34.57 17.44,34.57 RN1.8
N$1
  Top 0.152: 14.99,42.93 LED4.C
  Top 0.254: 14.99,42.93 R3.1
N$2  (via drill 0.25)
  Top 0.152: v20.59,31.14 21.35,32.21 21.35,33.05 v21.17,33.22
  Bottom 0.152: Y1.3 13.21,42.09 C40.2 15.22,41.99 20.97,41.99 21.22,41.73 v21.17,33.22 | U1.13 19.73,25.25 20.84,26.37 20.84,30.56 v20.59,31.14
N$3  (via drill 0.33)
  Top 0.152: R3.2 | R3.2 R4.2 17.38,45.16 v18.5,45.16 | LIPOCHARGER.1 13.03,48.91 v13.88,48.91
  Bottom 0.152: v13.88,48.91 v13.88,48.9 17.06,48.9 18.5,47.45 v18.5,45.16
N$4
  Bottom 0.152: Y1.1 9.76,42.2 C41.2 10.17,41.66 10.17,40.84 10.91,39.65 15.35,39.65 16.17,39.19 16.17,34.98 16.62,34.42 16.62,33.86 16.88,33.6 17.54,33.6 17.9,34.01 18.33,34.01 18.35,33.98 20.13,32.11 20.08,31.57 19.93,31.42 19.93,30.91 20.46,30.56 20.46,26.49 19.72,25.75 U1.12
N$5  (via drill 0.33)
  Top 0.152: R2.2 5.47,38.42 Q1.1 6.69,38.89 7.25,39.45 16.27,39.45 16.9,40.46 20.46,40.46 21.04,39.47 21.04,38.07 v20.59,37.03
  Bottom 0.152: v20.59,37.03 19.78,37.03 RN1.4
N$6  (via drill 0.25)
  Top 0.152: v19.11,37.64 19.82,37.54 19.82,36.62 18.86,35.91 LED1.B
  Bottom 0.152: RN1.3 18.63,37.24 v19.11,37.64
N$8  (via drill 0.33)
  Top 0.152: LED1.R 17.21,39.37 17.67,40.21 19.82,40.21 v20.46,39.19
  Bottom 0.152: RN1.1 17.16,36.81 17.16,37.41 17.41,38.28 19.93,38.28 20.33,38.68 20.33,39.07 v20.46,39.19
N$9  (via drill 0.25)
  Top 0.152: LED1.G 17.28,36.96 v17.82,37.64
  Bottom 0.152: v17.82,37.64 18.05,37.41 18.05,36.9 RN1.2
N$10
  Top 0.152: R1.2 11.67,38.4 LED3.C
N$11
  Bottom 0.152: C7.1 15.17,5.58 REGULATOR.4
N$12  (via drill 0.33)
  Top 0.152: v18.86,14.12 v18.83,15.7
  Bottom 0.152: U1.20 U1.21 18.59,21.26 19.11,21.26 19.34,20.98 19.34,16.2 v18.83,15.7 | L1.1 C4.1 C5.1 18.4,12.01 18.85,12.71 v18.86,14.12
N$13
  Bottom 0.152: R5.2 6.27,11.34 R10.2 6.47,10.84 CONVERTER.4
N$14
  Top 0.152: Q1.3 8.79,37.4 9.41,36.78 10.08,36.78 R1.1
N$15  (via drill 0.33)
  Top 0.152: R6.1 3.98,47.05 SJ1.2 2.37,47.05 3.14,46.21 3.36,46 4.36,45.99 5.12,45.67 v4.88,45.71 | 12.74,46.08 LIPOCHARGER.5 12.74,45.72 12.41,45.39 v11.76,45.39
  Bottom 0.152: v11.76,45.39 10.3,45.41 9.38,46.56 6.08,46.56 v4.88,45.71
N$16
  Top 0.152: LED5.A 15.06,46.4 R4.1
N$17  (1 unrouted)
N$18
  Top 0.152: SJ1.1 3.95,49.1 R7.1
N$19  (via drill 0.25)
  Top 0.152: IMAGE_SENSOR.G7 13.59,28.65 14.29,28.65 14.77,28.88 14.77,29.36 14.47,29.67 14.16,29.67 14.06,29.82 13.91,30.07 13.8,30.28 11.82,34.14 v11.82,34.75
  Bottom 0.152: RN4.5 9.9,35.15 10.05,35 11.57,35 v11.82,34.75
N$20  (via drill 0.25)
  Top 0.152: IMAGE_SENSOR.H8 13.09,31 11.29,34.42 10.99,34.72 v9.28,34.72
  Bottom 0.152: RN4.6 9.13,35.01 v9.28,34.72
NRST  (via drill 0.25)
  Top 0.152: v12.76,34.72 14.09,34.72 20.41,29.54 v20.4,25.16
  Bottom 0.152: C1.1 11.35,35.69 RN3.4 12.45,34.88 v12.76,34.72 | v20.4,25.16 19.95,24.84 18.63,24.84 U1.14
P$1
  Bottom 0.152: Y1.4 11.66,42.25 Y1.2
RAW  (via drill 0.25)
  Top 0.152: LIPOCHARGER.3 10.65,48.72 10.17,48.72 9.73,48.46 9.73,46.18 9.15,45.41 C22.1 9.4,44.78 12.2,44.78 12.76,44.27 12.76,40.11 12.28,39.75 3.47,39.75 | 3.47,39.75 0.5,37.52 0.5,30.89 2.76,29.26 2.7,18.72 2.7,17.75 3.59,16.87 7.43,16.87 8.69,15.52 9.57,15.52 10.8,14.29 10.8,13.9 v10.93,13.77 | VBAT.1 2.13,41.09 3.47,39.75
  Bottom 0.152: C44.2 7.36,6.7 7.42,7.55 CONVERTER.3 7.67,8.75 8.01,9.09 9.32,9.09 9.57,8.84 | CONVERTER.1 9.57,8.84 | 9.57,8.84 9.57,9.13 10.11,9.67 10.11,10.68 10.43,11 10.83,11 10.93,11.1 v10.93,13.77
SPI3_MISO  (via drill 0.25)
  Top 0.152: v15.89,24.51 15.61,24.21 14.15,24.21 IMAGE_SENSOR.H3
  Bottom 0.152: U1.90 11.82,31.83 12.46,31.09 15.51,31.09 15.96,30.68 15.96,24.59 v15.89,24.51
SPI3_MOSI  (via drill 0.25)
  Top 0.152: IMAGE_SENSOR.G3 13.05,24.13 12.46,24.71 v10.3,24.71 | v10.55,34.11 10.35,33.91 10.35,32.46 11.11,31.7 v11.32,31.7
  Bottom 0.152: v10.3,24.71 9.66,24.21 9,24.21 8.65,24.56 8.65,29.03 9.44,29.82 12.05,29.82 12.23,30 12.23,30.79 v11.32,31.7 | U1.91 12.31,32.99 12.31,33.78 11.98,34.11 v10.55,34.11
SPI3_SSEL  (via drill 0.25)
  Top 0.152: 5.73,31.7 v5.35,31.7 6.69,31.7 7.56,30.84 7.56,28.98 7.89,28.63 10.4,28.63 10.6,28.42 10.6,27.99 10.5,27.84 10.5,26.77 10.48,26.75 10.76,26.44 12.08,26.44 12.79,27.13 IMAGE_SENSOR.G6
  Bottom 0.152: U1.77 5.32,31.72 v5.35,31.7
SW
  Bottom 0.152: CONVERTER.5 9.57,12.22 L3.1
SWDCLKB
  Top 0.152: PROGPINS1.P$1 14.11,6.17 13.6,5.66 12.14,5.66 MOD1.4
SWDIOB
  Top 0.152: PROGPINS1.P$2 14.74,8.71 13.73,7.7 13.73,7.32 13.35,6.93 12.21,6.93 MOD1.5
UART2_RX  (via drill 0.25)
  Top 0.152: v8.27,18.87 8.27,17.35 v9.03,16.4 | MOD1.14 4.63,7.82 4.08,7.82 4.1,7.85 6.97,7.85 7.07,8 7.12,8.1 7.17,8.67 7.16,13.95 | 7.16,13.95 7.49,14.34 v8.19,14.34 | J1.OUT 5.79,15.44 7.16,13.95
  Bottom 0.152: v8.27,18.87 6.64,21.56 6.62,29.67 7.19,30.94 9.86,30.94 10.31,31.52 10.31,31.56 U1.87 | v8.19,14.34 8.67,14.35 9.08,15.01 v9.03,16.4
UART2_TX  (via drill 0.25)
  Top 0.152: v3.16,12.65 3.58,12.34 3.89,12.14 3.87,11.05 4.48,10.44 MOD1.13
  Bottom 0.152: 9.79,32.94 U1.86 | 9.79,32.69 U1.86 | U1.86 | U1.86 9.82,32.25 10.07,32 10.07,31.6 9.74,31.19 6.93,31.19 6.24,29.67 6.24,21.41 2.81,17.86 1.92,17.86 1.16,17.09 1.16,13.41 1.92,12.65 v3.16,12.65
VAA  (via drill 0.25)
  Top 0.152: C19.1 C20.1 C14.2 5.27,41.53 v5.27,41.45 | v2.53,36.55 3.5,36.55 3.73,36.65 L4.2 3.82,36.55 3.8,35.13 8.1,30.78 IMAGE_SENSOR.B8 IMAGE_SENSOR.C8 9.38,29.13 9.87,29.62 10.38,29.62 10.6,29.23 10.6,28.85 10.81,28.65 11.3,28.65 11.82,28.13 IMAGE_SENSOR.F7
  Bottom 0.152: v2.53,36.55 1.89,37.21 1.89,37.95 3.85,39.95 v5.27,41.45
VBAT  (via drill 0.25)
  Top 0.152: 10.78,42.68 C17.1 8.22,41.61 v7.76,41.61 | 10.78,42.68 C16.1 | v16.83,26.26 15.76,27.13 IMAGE_SENSOR.H6 13.58,26.51 13.55,25.91 13.3,25.65 12.64,25.65 12.2,25.37 10.27,25.37 9.69,24.97 9.69,24.33 9.99,23.93 10.5,23.93 11,23.13 IMAGE_SENSOR.E2 10.55,22.55 10.55,21.79 10.3,21.41 7.89,21.41 7.58,21.82 7.58,24.69 7.66,24.79 7.91,24.79 IMAGE_SENSOR.B4 IMAGE_SENSOR.A4 | IMAGE_SENSOR.A4 7.07,25.02 | v6.49,20.32 7.06,20.85 IMAGE_SENSOR.A1 6.52,22.79 6.52,24.69 6.64,24.82 6.91,24.82 IMAGE_SENSOR.A4 | LED2.A 12.66,36.57 12.78,36.46 | 12.78,36.46 14.11,35.13 15.25,35.13 | 15.25,35.13 15.76,35.64 15.76,36.91 16.75,38.12 17.84,38.12 LED1.A | v4.46,23.44 3.7,23.39 3.54,23.8 3.52,23.83 3.52,29.79 1.97,30.96 v1.97,31.25 | 15.25,35.13 v16.04,34.26 | v12.59,38.3 13.22,38.3 13.35,38.18 13.35,37.03 12.78,36.46 | v5.52,24.41 6.14,25.13 IMAGE_SENSOR.A4 | 10.78,42.68 11.14,42.08 C18.2 | v4.84,16.33 7.23,16.33 v7.38,16.18
  Bottom 0.152: L1.2 15.76,8.72 | RN4.3 RN4.4 9.91,37.24 RN3.5 12.45,38.17 v12.59,38.3 | 3.38,31.25 U1.75 2.86,31.25 v1.97,31.25 | C3.2 12.07,10.09 C8.1 | C8.1 C9.1 C13.1 12.44,13.51 11.49,14.45 10.78,14.45 9.97,13.64 8.01,13.64 7.81,13.44 L3.2 7.08,12.99 R10.1 6.47,14.43 C2.1 6.6,15.55 6.87,15.82 7.02,15.82 v7.38,16.18 | C8.1 12.73,10.36 REGULATOR.1 12.73,8.18 13.31,7.27 14.2,7.27 14.62,7.95 14.62,8.7 REGULATOR.3 | L1.2 14.92,9.01 REGULATOR.3 | L1.2 16.1,8.1 18.88,8.1 19.21,8.56 19.21,13.54 19.57,13.99 19.57,14.61 19.32,14.76 17.62,14.76 17.36,14.61 | C6.1 17.36,14.61 | 17.36,14.61 17.36,15.62 16.4,16.59 16.4,17.46 U1.27 | v4.84,16.33 4.71,16.46 4.71,17.42 U1.50 4.82,18.73 v6.49,20.32 | 14.62,9.35 14.62,8.73 REGULATOR.3 | RN4.3 9.16,37.31 9.16,39.98 v7.76,41.61 7.15,42.24 C11.A | v4.46,23.44 v5.52,24.41 | v16.04,34.26 16.78,33.35 U1.100 17.07,33.22 18.3,33.22 19.57,31.95 19.57,29.29 19.04,28.75 U1.6 19.47,28.75 20.21,28.4 20.21,26.62 19.82,26.24 18.56,26.24 U1.11 16.84,26.25 v16.83,26.26 | RN4.1 7.37,36.53 7.76,36.53 8.78,36.53 9.03,36.78 9.03,37.17 RN4.3
  Bottom 0.254: 15.51,8.76 L1.2
VCAP1  (via drill 0.25)
  Top 0.152: v4.05,17.88 4.9,18.87 5.05,19.02 5.7,19.02 v5.84,18.88 v5.84,18.87
  Bottom 0.152: C49.1 3.35,17.12 v4.05,17.88 | 5.85,17.56 U1.48 5.84,17.55 v5.84,18.87
  Bottom 0.254: U1.48
VCAP2
  Bottom 0.152: U1.73 2.6,30.25 1.46,30.71 1.46,31.78 2.15,32.46 2.15,33.66 2.62,34.12 C48.1 2.98,34.11
VCC
  Top 0.152: MOD1.8 12.3,10.62 18.43,10.62 19.19,9.86 19.19,6.68 18.68,6.17 PROGPINS1.P$3
VDD
  Top 0.152: 17.16,41.37 LED4.A 18.74,41.37 C21.1 19.41,41.45 19.89,41.92 19.89,46.6 19.24,47.24 16.84,47.24 JP4.1 | LIPOCHARGER.4 10.84,46.72 11.57,47.45 14.85,47.45 JP4.1 | USBC-CONNECTOR.B1 17.07,49.67 JP4.1
VDDA  (via drill 0.33)
  Top 0.152: v19.8,15.44 19.85,16.1 19.21,16.74 9.87,16.74 9.41,15.82 8.75,15.82 7.52,17.27 3.75,17.27 3.21,17.8 3.21,18.72 3.26,29.54 1.28,31.01 1.28,37.41 2.6,38.48 3.31,38.51 L4.1
  Bottom 0.152: C12.2 12,5.39 REGULATOR.5 12.73,2.72 13.14,1.93 14.11,1.93 14.67,2.62 19.16,2.62 19.98,3.43 19.98,6.27 19.06,7.65 19.06,7.95 19.47,8.51 19.47,13.44 19.82,13.89 19.82,14.71 v19.8,15.44